# EAGLE schematic Piezoverstärker_v3.0 (EAGLE 9.6.2)
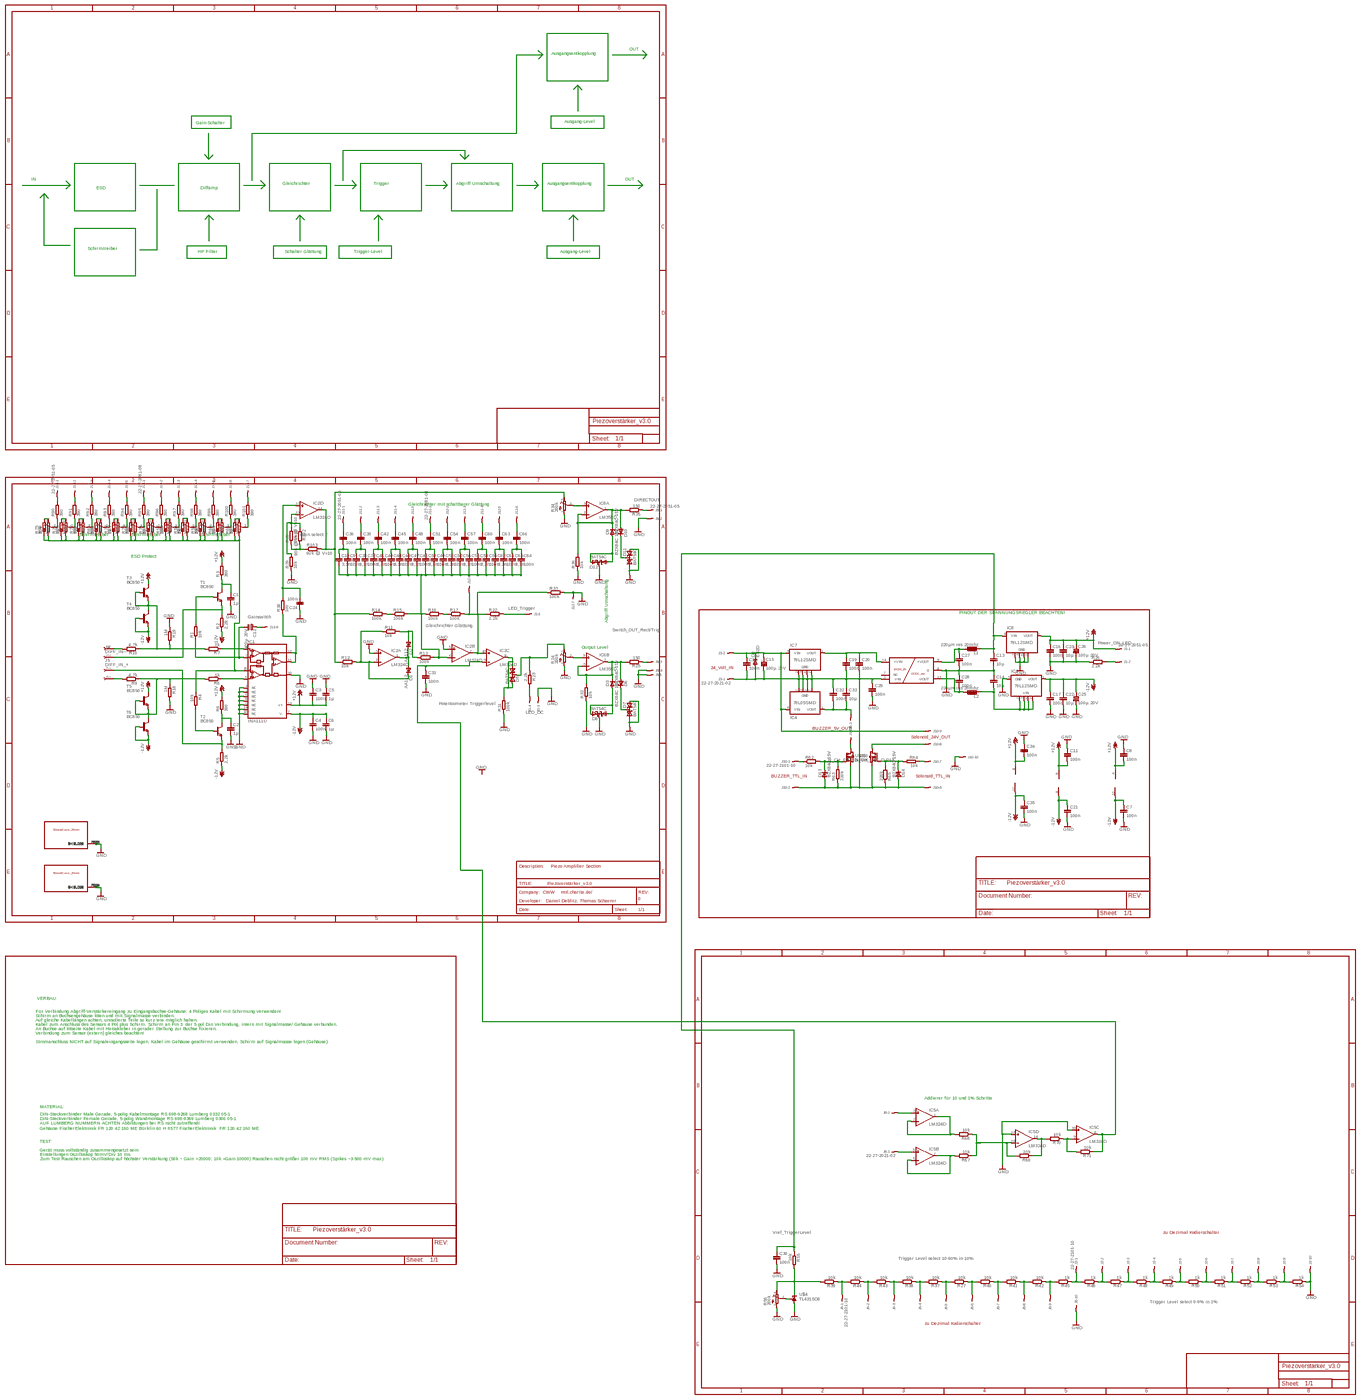
[diagram p0: schematic, sheet 1, overview]
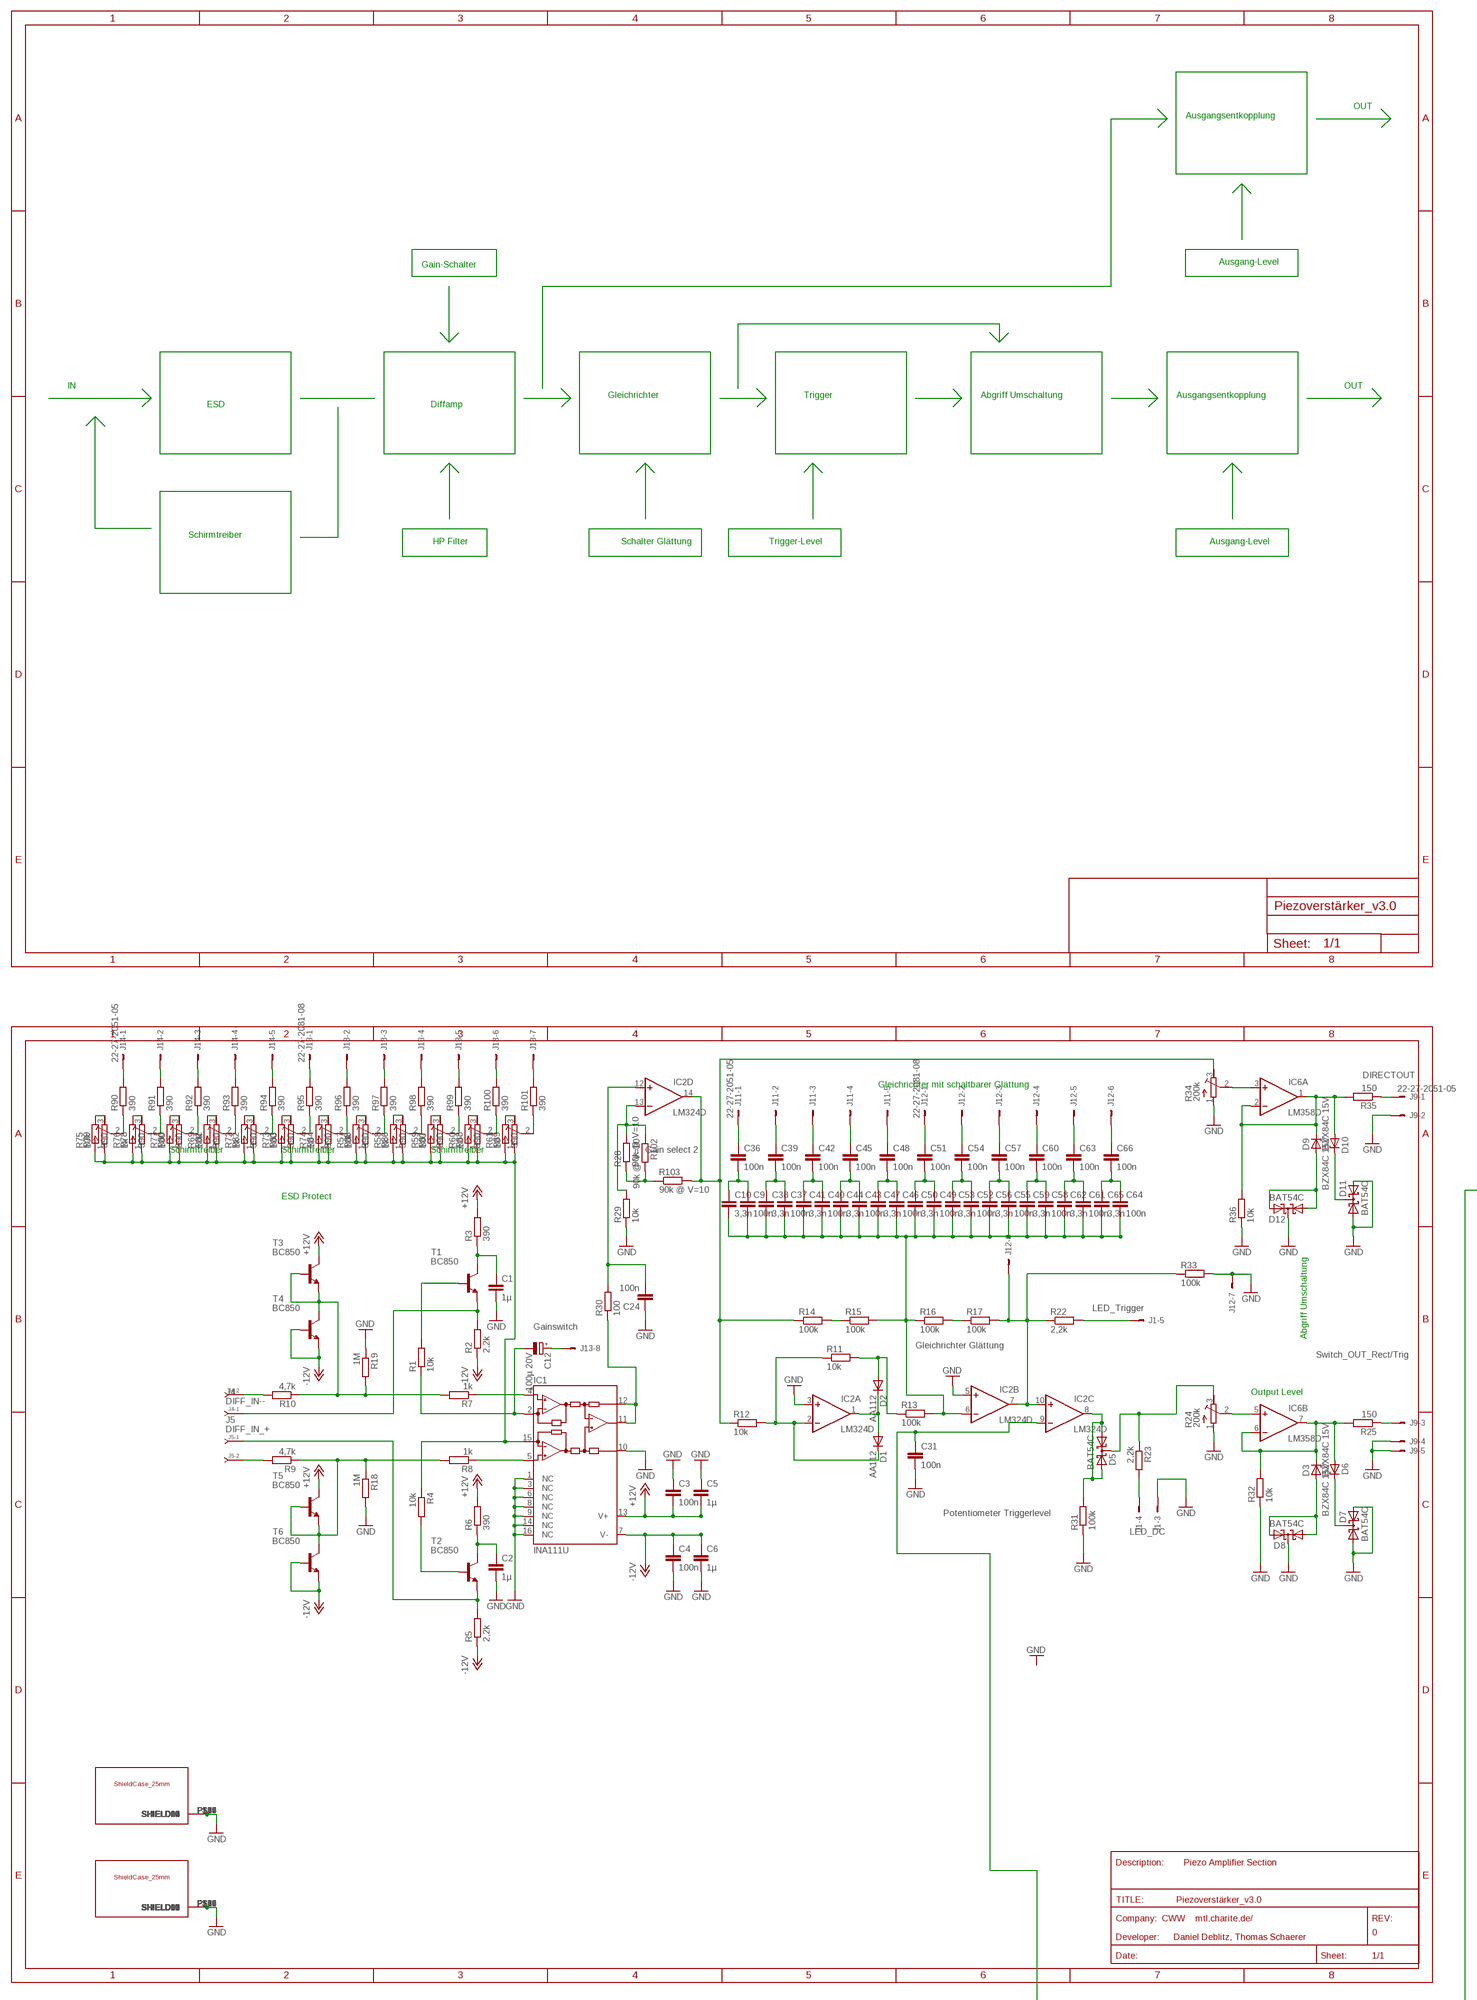
[diagram p1: schematic, sheet 1, part 1 of 4]
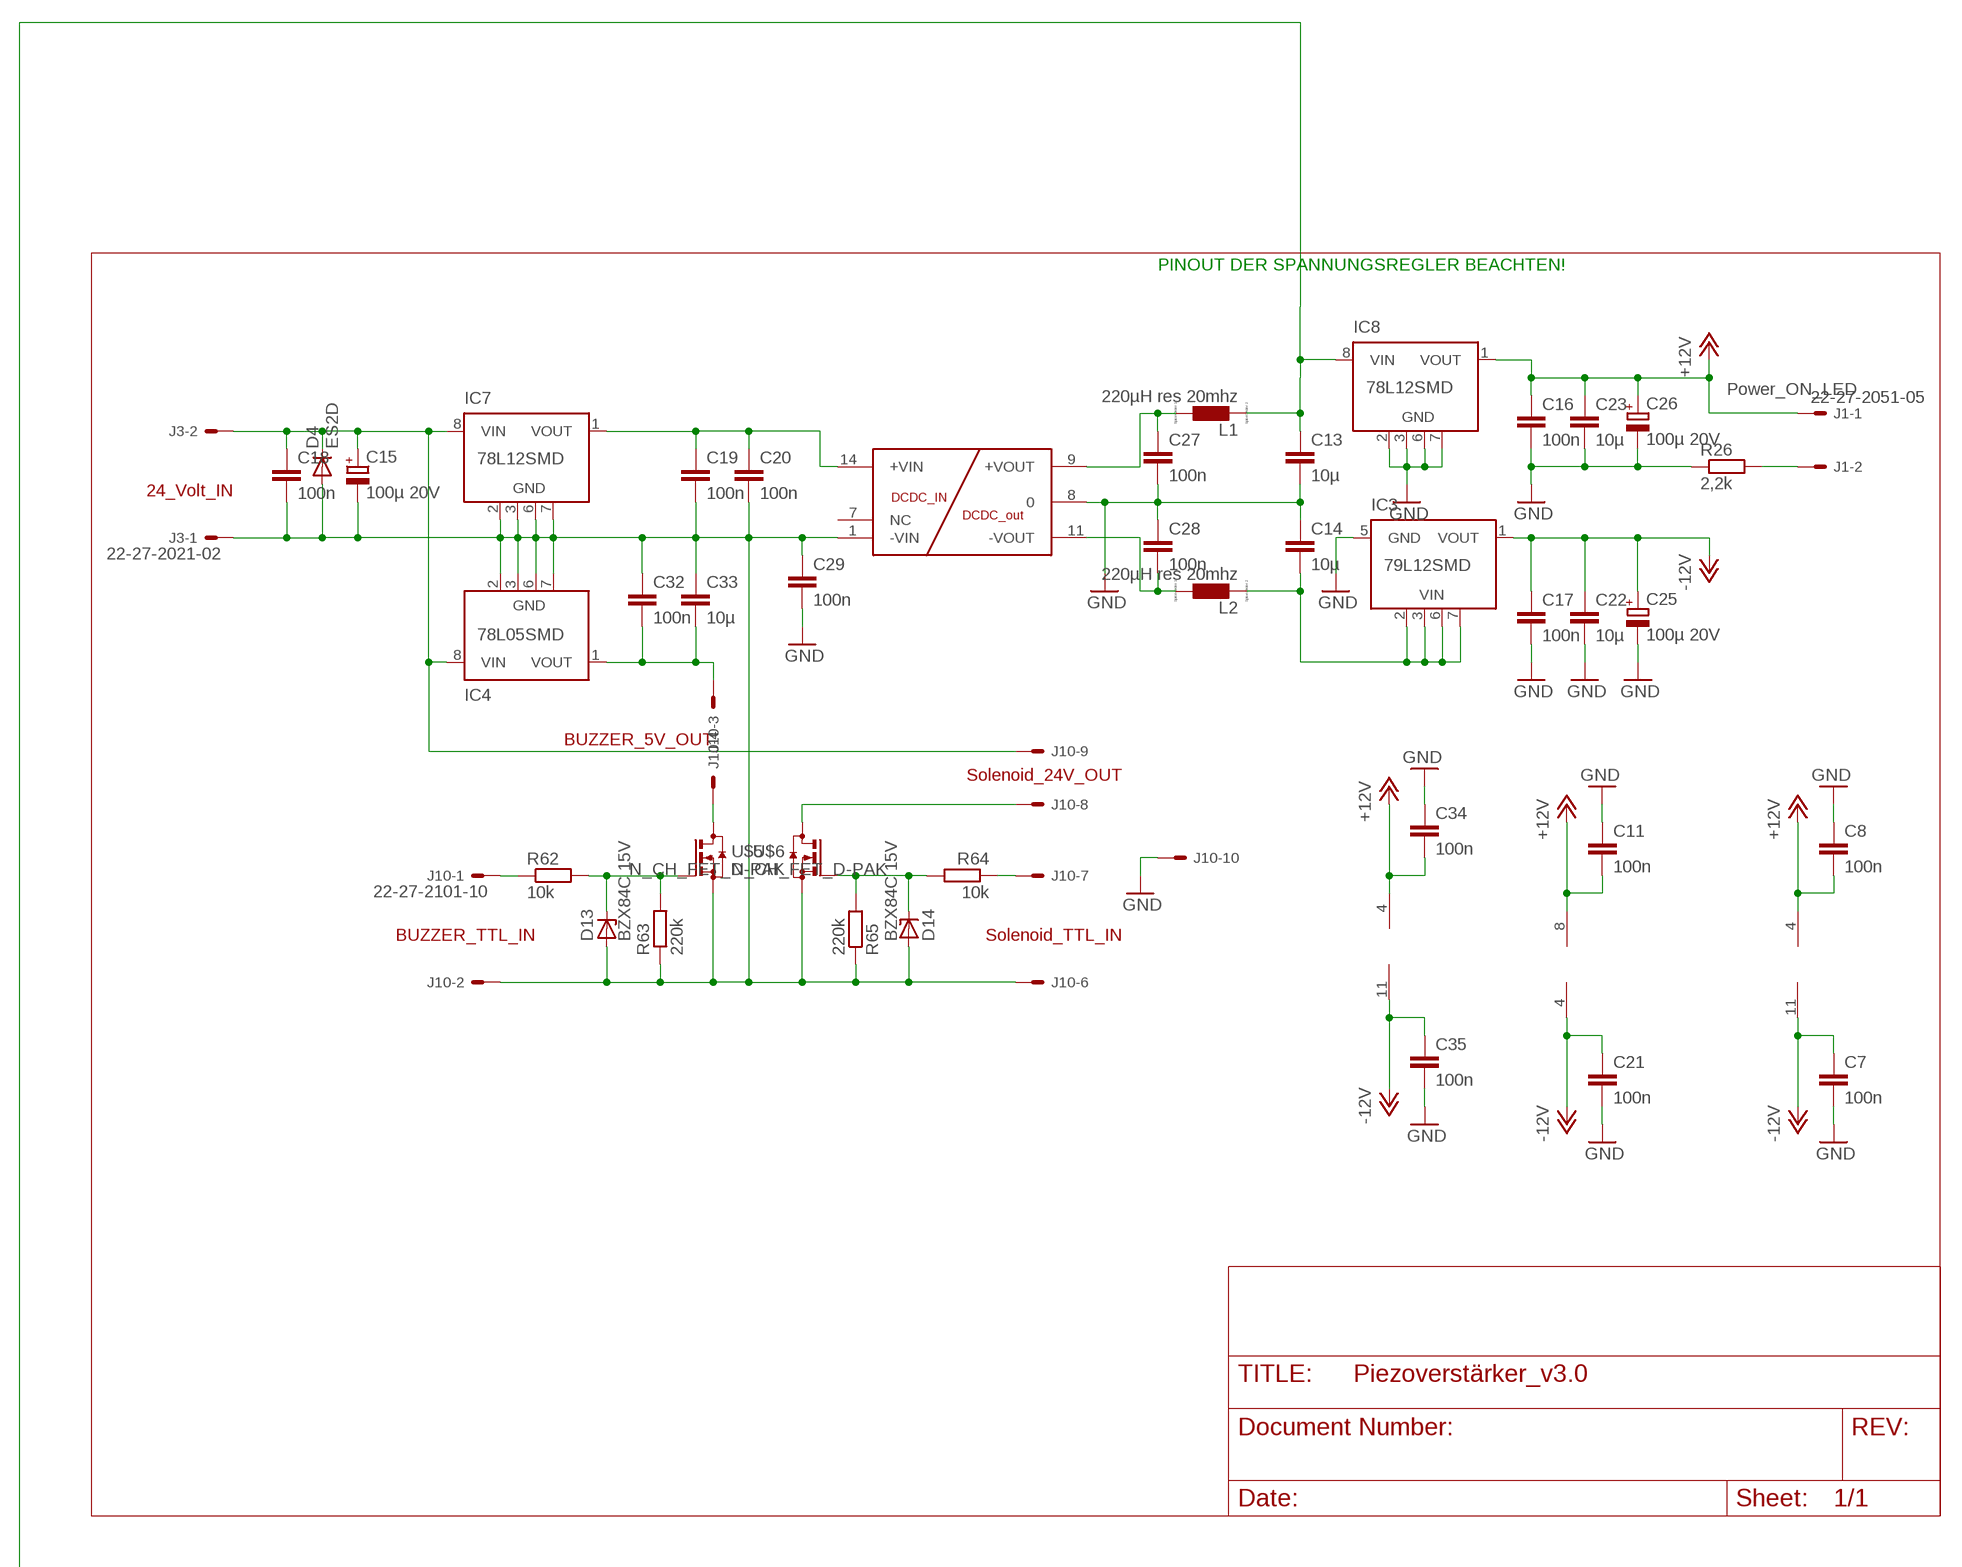
[diagram p2: schematic, sheet 1, part 2 of 4]
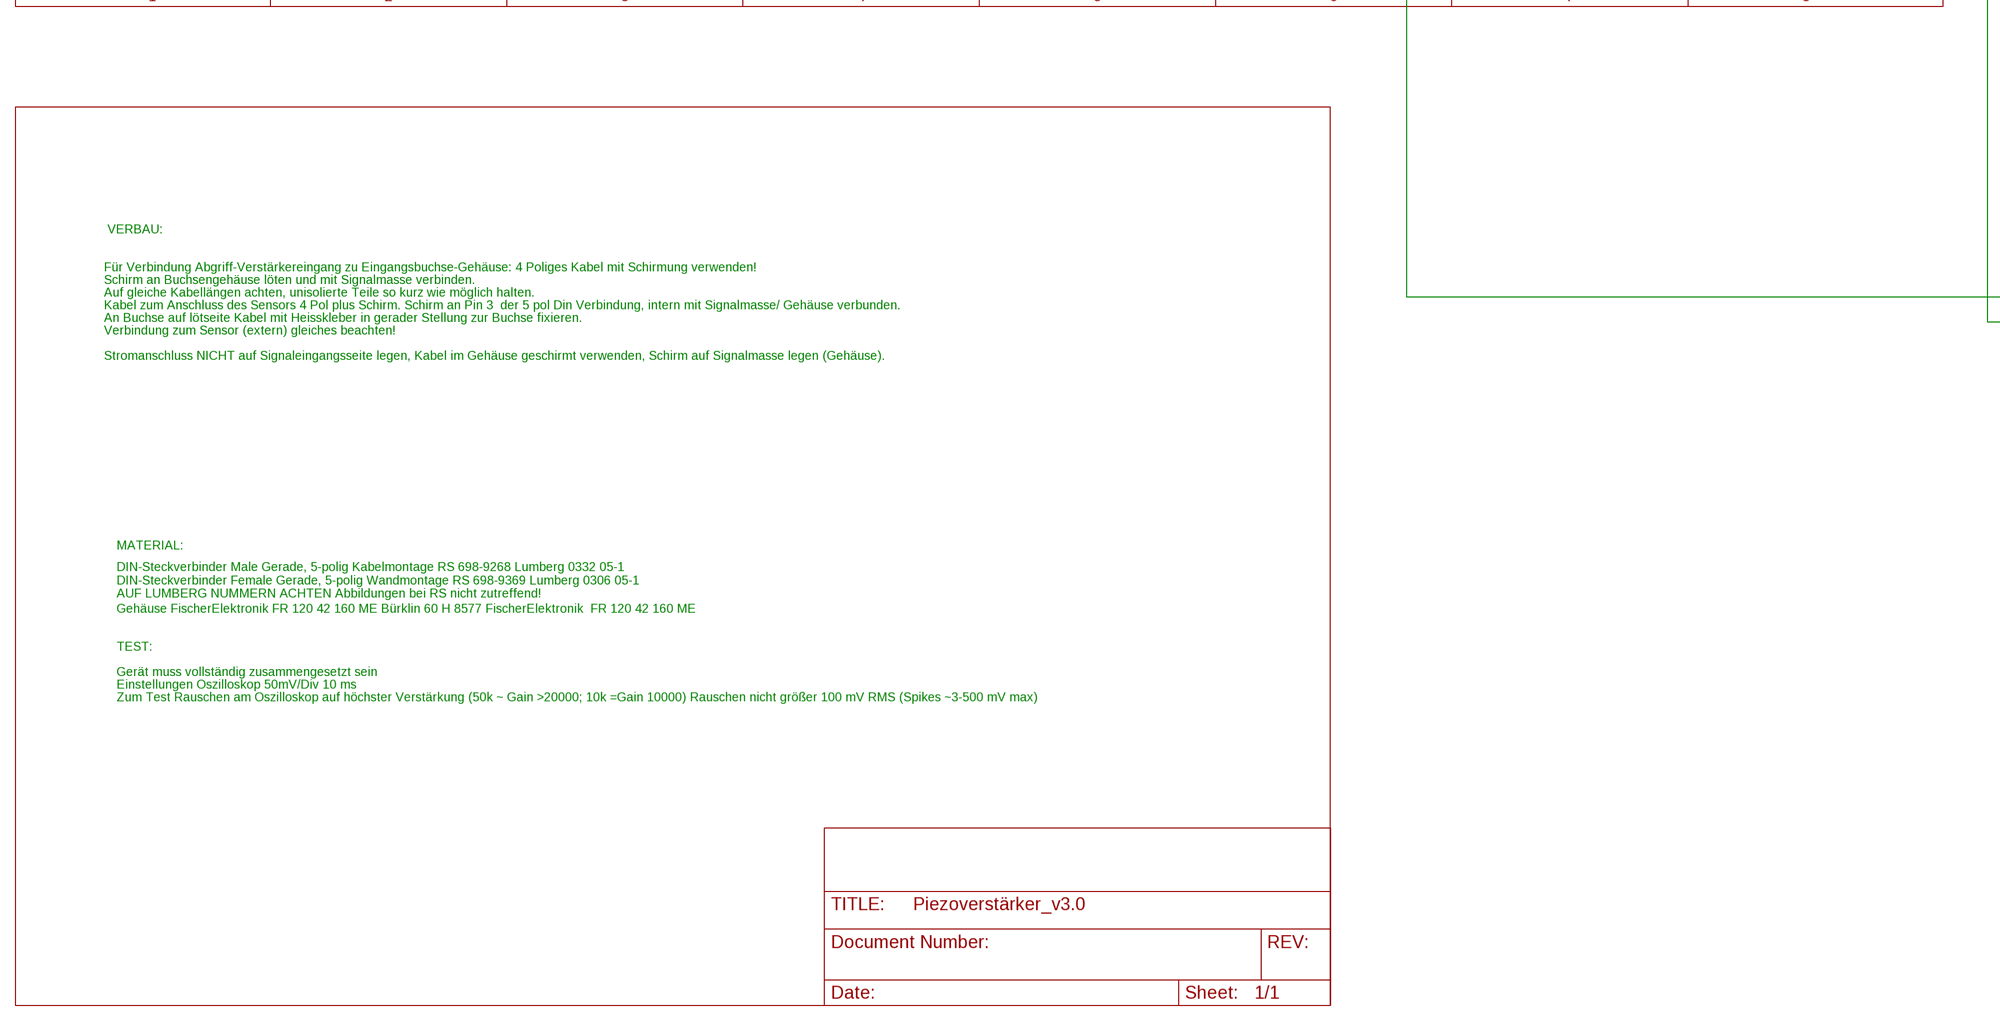
[diagram p3: schematic, sheet 1, part 3 of 4]
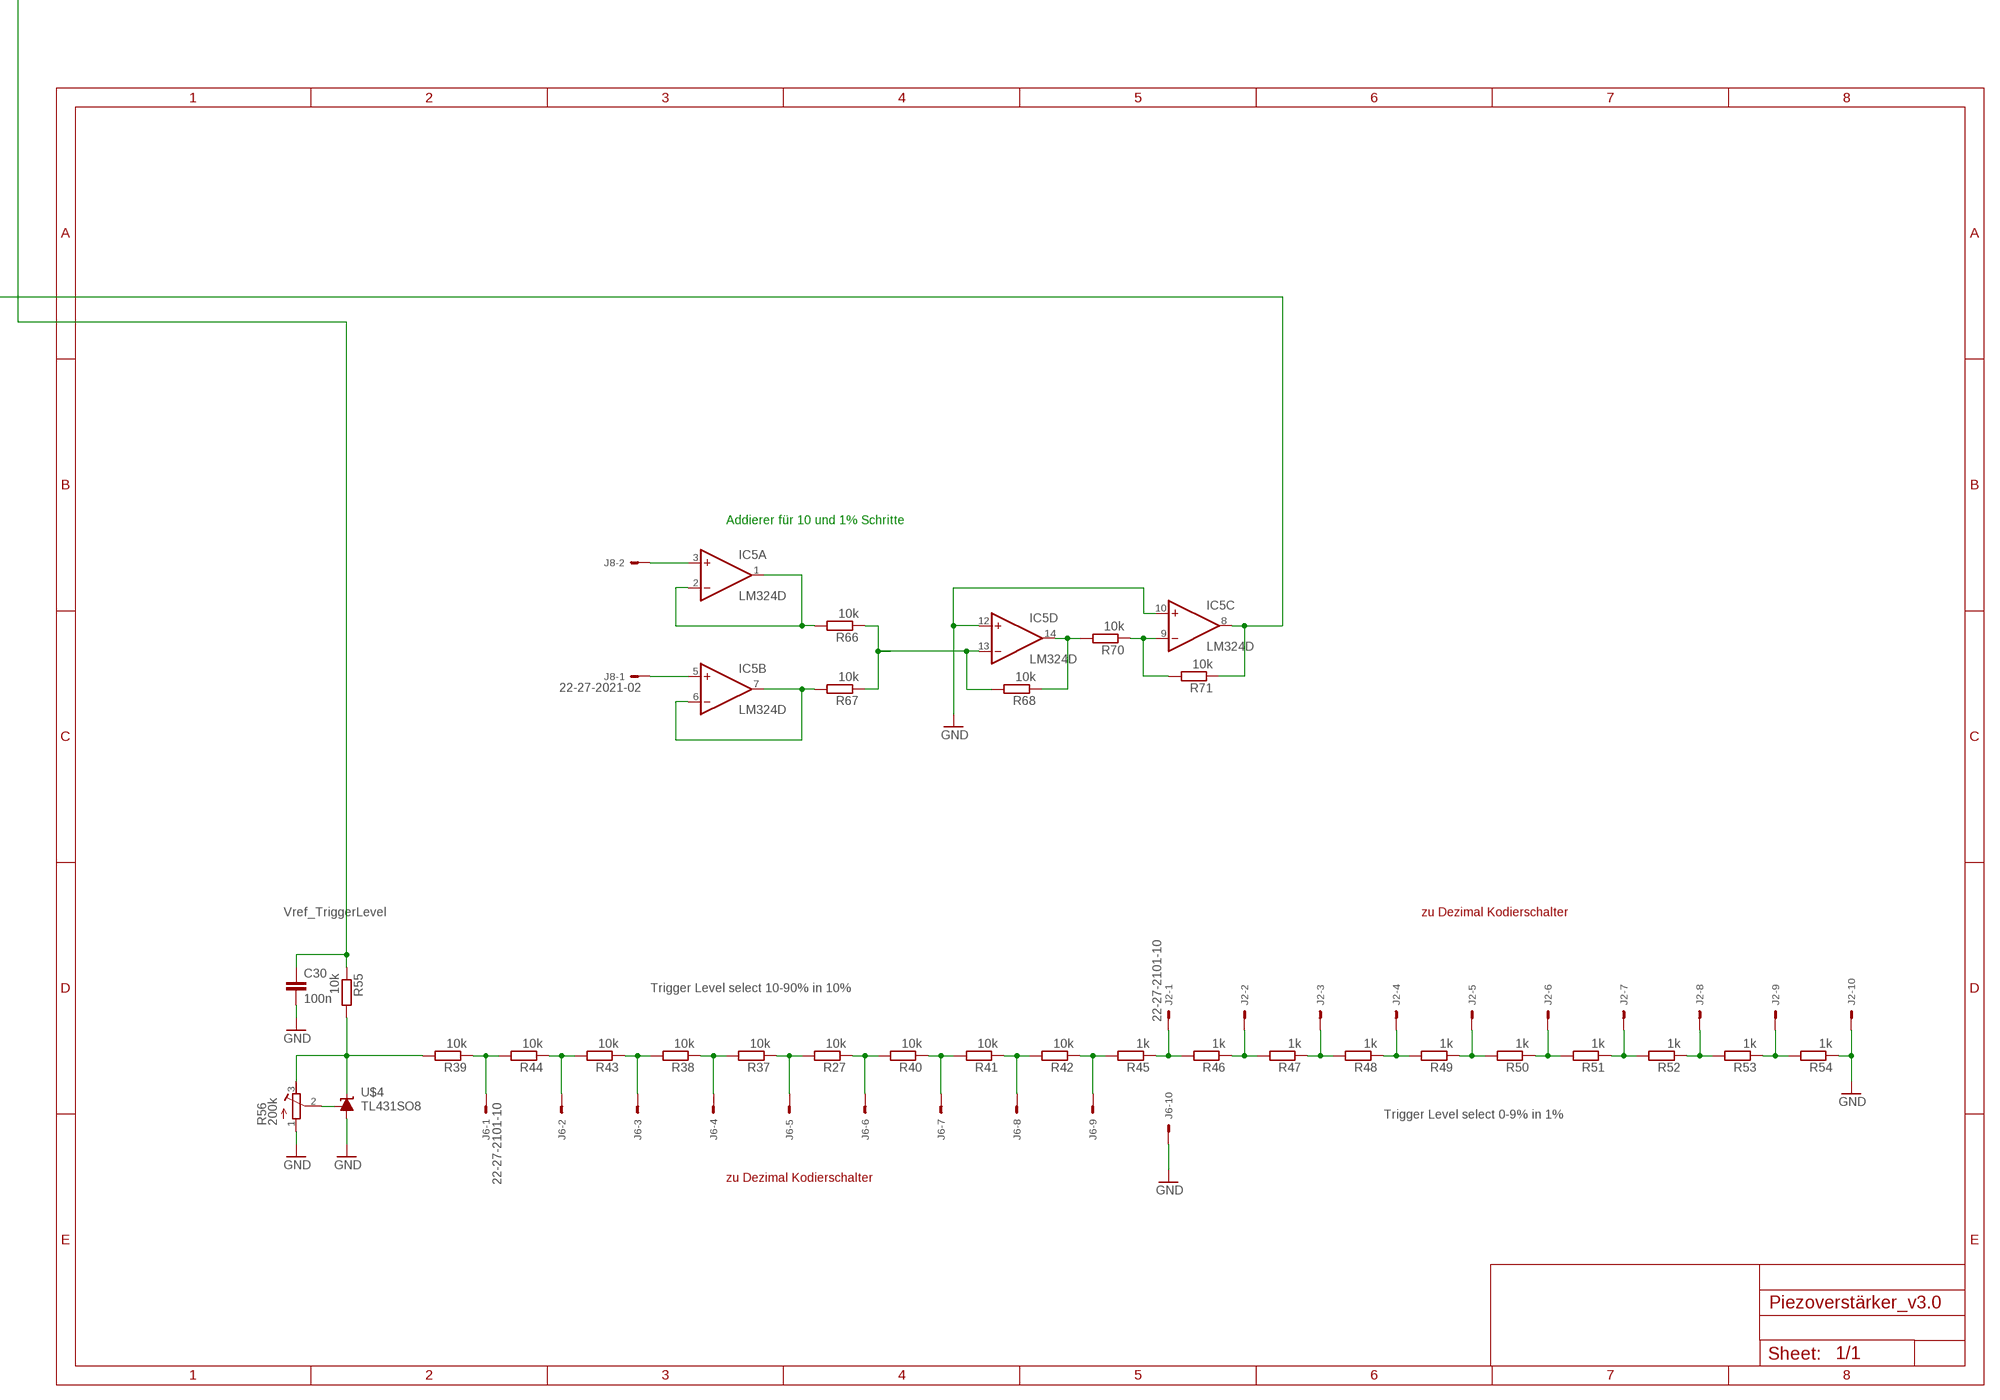
[diagram p4: schematic, sheet 1, part 4 of 4]

## Parts
C1  1µ  C-EUC0805  [C0805]
C2  1µ  C-EUC0805  [C0805]
C3  100n  C-EUC0805  [C0805]
C4  100n  C-EUC0805  [C0805]
C5  1µ  C-EUC0805  [C0805]
C6  1µ  C-EUC0805  [C0805]
C7  100n  C-EUC0805  [C0805]
C8  100n  C-EUC0805  [C0805]
C9  100n  C-EUC0805  [C0805]
C10  3,3n  C-EUC0805  [C0805]
C11  100n  C-EUC0805  [C0805]
C12  100µ 20V  CPOL-EUE  [PANASONIC_E]
C13  10µ  C-EUC0805  [C0805]
C14  10µ  C-EUC0805  [C0805]
C15  100µ 20V  CPOL-EUE  [PANASONIC_E]
C16  100n  C-EUC0805  [C0805]
C17  100n  C-EUC0805  [C0805]
C18  100n  C-EUC0805  [C0805]
C19  100n  C-EUC0805  [C0805]
C20  100n  C-EUC0805  [C0805]
C21  100n  C-EUC0805  [C0805]
C22  10µ  C-EUC0805  [C0805]
C23  10µ  C-EUC0805  [C0805]
C24  100n  C-EUC0805  [C0805]
C25  100µ 20V  CPOL-EUE  [PANASONIC_E]
C26  100µ 20V  CPOL-EUE  [PANASONIC_E]
C27  100n  C-EUC0805  [C0805]
C28  100n  C-EUC0805  [C0805]
C29  100n  C-EUC0805  [C0805]
C30  100n  C-EUC0805  [C0805]
C31  100n  C-EUC0805  [C0805]
C32  100n  C-EUC0805  [C0805]
C33  10µ  C-EUC0805  [C0805]
C34  100n  C-EUC0805  [C0805]
C35  100n  C-EUC0805  [C0805]
C36  100n  C-EUC0805  [C0805]
C37  100n  C-EUC0805  [C0805]
C38  3,3n  C-EUC0805  [C0805]
C39  100n  C-EUC0805  [C0805]
C40  100n  C-EUC0805  [C0805]
C41  3,3n  C-EUC0805  [C0805]
C42  100n  C-EUC0805  [C0805]
C43  100n  C-EUC0805  [C0805]
C44  3,3n  C-EUC0805  [C0805]
C45  100n  C-EUC0805  [C0805]
C46  100n  C-EUC0805  [C0805]
C47  3,3n  C-EUC0805  [C0805]
C48  100n  C-EUC0805  [C0805]
C49  100n  C-EUC0805  [C0805]
C50  3,3n  C-EUC0805  [C0805]
C51  100n  C-EUC0805  [C0805]
C52  100n  C-EUC0805  [C0805]
C53  3,3n  C-EUC0805  [C0805]
C54  100n  C-EUC0805  [C0805]
C55  100n  C-EUC0805  [C0805]
C56  3,3n  C-EUC0805  [C0805]
C57  100n  C-EUC0805  [C0805]
C58  100n  C-EUC0805  [C0805]
C59  3,3n  C-EUC0805  [C0805]
C60  100n  C-EUC0805  [C0805]
C61  100n  C-EUC0805  [C0805]
C62  3,3n  C-EUC0805  [C0805]
C63  100n  C-EUC0805  [C0805]
C64  100n  C-EUC0805  [C0805]
C65  3,3n  C-EUC0805  [C0805]
C66  100n  C-EUC0805  [C0805]
D1  AA112  [DO07]
D2  AA112  [DO07]
D3  BZX84C 15V  BZX84CSMD  [TO236]
D4  ES2D  [SMB]
D5  BAT54C  [SOT23]
D6  BZX84C 15V  BZX84CSMD  [TO236]
D7  BAT54C  [SOT23]
D8  BAT54C  [SOT23]
D9  BZX84C 15V  BZX84CSMD  [TO236]
D10  BZX84C 15V  BZX84CSMD  [TO236]
D11  BAT54C  [SOT23]
D12  BAT54C  [SOT23]
D13  BZX84C 15V  BZX84CSMD  [TO236]
D14  BZX84C 15V  BZX84CSMD  [TO236]
IC1  INA111U  [SO16-1]
IC2  LM324D  [SO14]
IC3  79L12SMD  [SO08]
IC4  78L05SMD  78L12SMD  [SO08]
IC5  LM324D  [SO14]
IC6  LM358D  [SO08]
IC7  78L12SMD  [SO08]
IC8  78L12SMD  [SO08]
J1  22-27-2051-05  [6410-05]
J2  22-27-2101-10  [6410-10]
J3  22-27-2021-02  [6410-02]
J4  DIFF_IN--  J-02-SIP-100-40  [SIP-100-02-40]
J5  DIFF_IN_+  J-02-SIP-100-40  [SIP-100-02-40]
J6  22-27-2101-10  [6410-10]
J8  22-27-2021-02  [6410-02]
J9  22-27-2051-05  [6410-05]
J10  22-27-2101-10  [6410-10]
J11  22-27-2051-05  [6410-05]
J12  22-27-2081-08  [6410-08]
J13  22-27-2081-08  [6410-08]
J14  22-27-2051-05  [6410-05]
L1  220µH res 20mhz  LL4532P  [L4532P]
L2  220µH res 20mhz  LL4532P  [L4532P]
R1  10k  R-EU_R0805  [R0805]
R2  2,2k  R-EU_R0805  [R0805]
R3  390  R-EU_R0805  [R0805]
R4  10k  R-EU_R0805  [R0805]
R5  2,2k  R-EU_R0805  [R0805]
R6  390  R-EU_R0805  [R0805]
R7  1k  R-EU_R0805  [R0805]
R8  1k  R-EU_R0805  [R0805]
R9  4,7k  R-EU_R0805  [R0805]
R10  4,7k  R-EU_R0805  [R0805]
R11  10k  R-EU_R0805  [R0805]
R12  10k  R-EU_R0805  [R0805]
R13  100k  R-EU_R0805  [R0805]
R14  100k  R-EU_R0805  [R0805]
R15  100k  R-EU_R0805  [R0805]
R16  100k  R-EU_R0805  [R0805]
R17  100k  R-EU_R0805  [R0805]
R18  1M  R-EU_R0805  [R0805]
R19  1M  R-EU_R0805  [R0805]
R22  2,2k  R-EU_R0805  [R0805]
R23  2,2k  R-EU_R0805  [R0805]
R24  200k  R-TRIMM74W  [RTRIM74W]
R25  150  R-EU_R0805  [R0805]
R26  2,2k  R-EU_R0805  [R0805]
R27  10k  R-EU_R0805  [R0805]
R28  90k @ V=10  R-EU_R0805  [R0805]
R29  10k  R-EU_R0805  [R0805]
R30  100  R-EU_R0805  [R0805]
R31  100k  R-EU_R0805  [R0805]
R32  10k  R-EU_R0805  [R0805]
R33  100k  R-EU_R0805  [R0805]
R34  200k  R-TRIMM74W  [RTRIM74W]
R35  150  R-EU_R0805  [R0805]
R36  10k  R-EU_R0805  [R0805]
R37  10k  R-EU_R0805  [R0805]
R38  10k  R-EU_R0805  [R0805]
R39  10k  R-EU_R0805  [R0805]
R40  10k  R-EU_R0805  [R0805]
R41  10k  R-EU_R0805  [R0805]
R42  10k  R-EU_R0805  [R0805]
R43  10k  R-EU_R0805  [R0805]
R44  10k  R-EU_R0805  [R0805]
R45  1k  R-EU_R0805  [R0805]
R46  1k  R-EU_R0805  [R0805]
R47  1k  R-EU_R0805  [R0805]
R48  1k  R-EU_R0805  [R0805]
R49  1k  R-EU_R0805  [R0805]
R50  1k  R-EU_R0805  [R0805]
R51  1k  R-EU_R0805  [R0805]
R52  1k  R-EU_R0805  [R0805]
R53  1k  R-EU_R0805  [R0805]
R54  1k  R-EU_R0805  [R0805]
R55  10k  R-EU_R0805  [R0805]
R56  200k  R-TRIMM74W  [RTRIM74W]
R57  10k  R-TRIMM74W  [RTRIM74W]
R58  1k  R-TRIMM74W  [RTRIM74W]
R59  100  R-TRIMM74W  [RTRIM74W]
R60  10  R-TRIMM74W  [RTRIM74W]
R61  10  R-TRIMM74W  [RTRIM74W]
R62  10k  R-EU_R0805  [R0805]
R63  220k  R-EU_R0805  [R0805]
R64  10k  R-EU_R0805  [R0805]
R65  220k  R-EU_R0805  [R0805]
R66  10k  R-EU_R0805  [R0805]
R67  10k  R-EU_R0805  [R0805]
R68  10k  R-EU_R0805  [R0805]
R69  10k  R-TRIMM74W  [RTRIM74W]
R70  10k  R-EU_R0805  [R0805]
R71  10k  R-EU_R0805  [R0805]
R72  1k  R-TRIMM74W  [RTRIM74W]
R73  100  R-TRIMM74W  [RTRIM74W]
R74  10  R-TRIMM74W  [RTRIM74W]
R75  10k  R-TRIMM74W  [RTRIM74W]
R76  1k  R-TRIMM74W  [RTRIM74W]
R77  100  R-TRIMM74W  [RTRIM74W]
R78  390  R-EU_R0805  [R0805]
R79  390  R-EU_R0805  [R0805]
R80  390  R-EU_R0805  [R0805]
R81  390  R-EU_R0805  [R0805]
R82  390  R-EU_R0805  [R0805]
R83  390  R-EU_R0805  [R0805]
R84  390  R-EU_R0805  [R0805]
R85  390  R-EU_R0805  [R0805]
R86  390  R-EU_R0805  [R0805]
R87  390  R-EU_R0805  [R0805]
R88  390  R-EU_R0805  [R0805]
R89  390  R-EU_R0805  [R0805]
R90  390  R-EU_R0805  [R0805]
R91  390  R-EU_R0805  [R0805]
R92  390  R-EU_R0805  [R0805]
R93  390  R-EU_R0805  [R0805]
R94  390  R-EU_R0805  [R0805]
R95  390  R-EU_R0805  [R0805]
R96  390  R-EU_R0805  [R0805]
R97  390  R-EU_R0805  [R0805]
R98  390  R-EU_R0805  [R0805]
R99  390  R-EU_R0805  [R0805]
R100  390  R-EU_R0805  [R0805]
R101  390  R-EU_R0805  [R0805]
R102  90k @ V=10  R-EU_R0805  [R0805]
R103  90k @ V=10  R-EU_R0805  [R0805]
T1  BC850  [SOT23]
T2  BC850  [SOT23]
T3  BC850  [SOT23]
T4  BC850  [SOT23]
T5  BC850  [SOT23]
T6  BC850  [SOT23]
U$1  MURATA_DCDC_NMA1215DC  MURATA_DCDC_NMA1212DC  [MURRATA_NMA_DCDC]
U$2  ABSCHIRMGEHäUSE_SMD_25MM  [ABSCHIRMGEHäUSE_SMD_25MM]
U$3  ABSCHIRMGEHäUSE_SMD_25MM  [ABSCHIRMGEHäUSE_SMD_25MM]
U$4  TL431SO8  [SO08]
U$5  N_CH_FET_D-PAK  [TO252]
U$6  N_CH_FET_D-PAK  [TO252]

## Nets
+12V: C3.2 C5.2 C8.2 C11.2 C16.1 C23.1 C26.+ C34.2 IC1.13(V+) IC2.4(P:V+) IC5.4(P:V+) IC6.8(P:V+) IC8.1(VOUT) J1.1 R3.2 R6.2 T3.3(C) T5.3(C)
+12VDC_DIRTY: C13.1 C30.1 IC8.8(VIN) L1.2 R55.1
-12V: C4.1 C6.1 C7.1 C17.1 C21.1 C22.1 C25.+ C35.1 IC1.7(V-) IC2.11(P:V-) IC3.1(VOUT) IC5.11(P:V-) IC6.4(P:V-) R2.1 R5.1 T4.1(B) T4.2(E) T6.1(B) T6.2(E)
DIFF_+: R8.2 R9.1 R18.1 T5.1(B) T5.2(E) T6.3(C)
DIFF_-: R7.2 R10.1 R19.2 T3.1(B) T3.2(E) T4.3(C)
GND: C1.2 C2.2 C3.1 C4.2 C5.1 C6.2 C7.2 C8.1 C11.1 C13.2 C14.1 C16.2 C17.2 C21.2 C22.2 C23.2 C24.1 C25.- C26.- C27.2 C28.1 C29.2 C30.2 C31.2 C34.1 C35.2 D7.1(A1) D7.2(A2) D8.3(CC) D11.1(A1) D11.2(A2) D12.3(CC) IC1.1(NC) IC1.3(NC) IC1.6(NC) IC1.8(NC) IC1.9(NC) IC1.10(REF) IC1.14(NC) IC1.16(NC) IC2.3(A:+IN) IC2.5(B:+IN) IC3.5(GND) IC5.10(C:+IN) IC5.12(D:+IN) IC8.2(GND) IC8.3(GND) IC8.6(GND) IC8.7(GND) J1.3 J2.10 J6.10 J9.2 J9.4 J9.5 J10.10 J12.7 R18.2 R19.1 R24.1(E) R26.1 R29.1 R31.1 R32.1 R33.2 R34.1(E) R36.1 R54.1 R56.1(E) U$1.8 U$2.P$1(SHIELD00) U$2.P$2(SHIELD01) U$2.P$3(SHIELD02) U$2.P$4(SHIELD03) U$2.P$5(SHIELD04) U$2.P$6(SHIELD05) U$2.P$7(SHIELD06) U$2.P$8(SHIELD07) U$2.P$9(SHIELD08) U$2.P$10(SHIELD09) U$2.P$11(SHIELD10) U$2.P$12(SHIELD11) U$2.P$13(SHIELD12) U$2.P$14(SHIELD13) U$2.P$15(SHIELD14) U$2.P$16(SHIELD15) U$2.P$17(SHIELD16) U$2.P$18(SHIELD17) U$2.P$19(SHIELD18) U$2.P$20(SHIELD19) U$3.P$1(SHIELD00) U$3.P$2(SHIELD01) U$3.P$3(SHIELD02) U$3.P$4(SHIELD03) U$3.P$5(SHIELD04) U$3.P$6(SHIELD05) U$3.P$7(SHIELD06) U$3.P$8(SHIELD07) U$3.P$9(SHIELD08) U$3.P$10(SHIELD09) U$3.P$11(SHIELD10) U$3.P$12(SHIELD11) U$3.P$13(SHIELD12) U$3.P$14(SHIELD13) U$3.P$15(SHIELD14) U$3.P$16(SHIELD15) U$3.P$17(SHIELD16) U$3.P$18(SHIELD17) U$3.P$19(SHIELD18) U$3.P$20(SHIELD19) U$4.2(A)
N$1: C1.1 R3.1 T1.3(C)
N$2: IC1.11(OUT) IC1.12(FB) R30.1
N$3: R1.2 T1.1(B)
N$4: C12.- IC1.2(RG) R1.1
N$5: C2.1 R6.1 T2.3(C)
N$6: IC1.5(+IN) R8.1
N$7: R4.2 T2.1(B)
N$8: R75.2(S) R90.1
N$9: IC1.4(-IN) R7.1
N$10: R75.3(A) R79.2
N$11: J4.2 R10.2
N$12: J5.2 R9.2
N$13: IC6.5(B:+IN) R24.2(S)
N$14: C12.+ J13.8
N$15: D1.A D2.C IC2.1(A:OUT)
N$16: D5.1(A1) D5.2(A2) IC2.8(C:OUT) R31.2
N$17: D2.A R11.2 R13.1
N$18: J9.3 R25.1
N$19: C28.2 L2.1 U$1.11(-VOUT)
N$20: R14.2 R15.1
N$21: R16.2 R17.1
N$22: IC2.7(B:OUT) IC2.10(C:+IN) J12.8 R17.2 R22.1 R33.1
N$23: C9.2 C10.2 C37.2 C38.2 C40.2 C41.2 C43.2 C44.2 C46.2 C47.2 C49.2 C50.2 C52.2 C53.2 C55.2 C56.2 C58.2 C59.2 C61.2 C62.2 C64.2 C65.2 IC2.6(B:-IN) R13.2 R15.2 R16.1
N$24: C9.1 C10.1 C36.2
N$25: C45.1 J11.4
N$27: C37.1 C38.1 C39.2
N$28: R76.3(A) R78.2
N$29: R77.3(A) R80.2
N$30: J1.5 R22.2
N$31: J1.4 R23.2
N$32: R39.2 R55.2 R56.3(A) U$4.1(C)
N$33: D5.3(CC) R23.1 R24.3(A)
N$34: D3.A D8.1(A1) D8.2(A2)
N$35: D3.C D6.A IC6.6(B:-IN) IC6.7(B:OUT) R25.2 R32.2
N$37: C27.1 L1.1 U$1.9(+VOUT)
N$38: J2.9 R53.1 R54.2
N$39: C15.+ C18.1 D4.C IC4.8(VIN) IC7.8(VIN) J3.2 J10.9
N$40: C19.1 C20.1 IC7.1(VOUT) U$1.14(+VIN)
N$66: D1.C IC2.2(A:-IN) R11.1 R12.2
N$67: D6.C D7.3(CC)
N$70: D9.C D10.A IC6.1(A:OUT) IC6.2(A:-IN) R35.2 R36.2
N$71: IC6.3(A:+IN) R34.2(S)
N$72: J9.1 R35.1
N$73: J1.2 R26.2
N$74: D9.A D12.1(A1) D12.2(A2)
N$75: D10.C D11.3(CC)
N$76: IC2.13(D:-IN) R28.2 R29.2 R102.1
N$77: C42.1 J11.3
N$78: IC2.14(D:OUT) R12.1 R14.1 R34.3(A) R103.2
N$79: J2.8 R52.1 R53.2
N$80: C24.2 IC2.12(D:+IN) R30.2
N$81: J2.7 R51.1 R52.2
N$82: J2.6 R50.1 R51.2
N$83: J2.5 R49.1 R50.2
N$84: J2.4 R48.1 R49.2
N$85: J2.3 R47.1 R48.2
N$86: J2.2 R46.1 R47.2
N$87: J2.1 R45.1 R46.2
N$88: J6.9 R42.1 R45.2
N$89: J6.8 R41.1 R42.2
N$90: J6.7 R40.1 R41.2
N$91: J6.6 R27.1 R40.2
N$92: J6.5 R27.2 R37.1
N$93: J6.4 R37.2 R38.1
N$94: J6.3 R38.2 R43.1
N$95: J6.2 R43.2 R44.1
N$96: J6.1 R39.1 R44.2
N$97: R56.2(S) U$4.8(FB)
N$98: C40.1 C41.1 C42.2
N$99: C39.1 J11.2
N$100: C43.1 C44.1 C45.2
N$101: C36.1 J11.1
N$102: IC1.15(RG) R4.1 R57.1(E) R58.1(E) R59.1(E) R60.1(E) R61.1(E) R69.1(E) R72.1(E) R73.1(E) R74.1(E) R75.1(E) R76.1(E) R77.1(E) R78.1 R79.1 R80.1 R81.1 R82.1 R83.1 R84.1 R85.1 R86.1 R87.1 R88.1 R89.1
N$103: C32.2 C33.2 IC4.1(VOUT) J10.3
N$104: J10.4 U$5.3(D)
N$105: J10.1 R62.1
N$106: D13.C R62.2 R63.2 U$5.1(G)
N$107: J10.8 U$6.3(D)
N$108: J10.7 R64.1
N$109: D14.C R64.2 R65.2 U$6.1(G)
N$110: IC5.6(B:-IN) IC5.7(B:OUT) R67.2
N$111: IC5.1(A:OUT) IC5.2(A:-IN) R66.2
N$112: IC5.5(B:+IN) J8.1
N$113: IC5.3(A:+IN) J8.2
N$114: C46.1 C47.1 C48.2
N$115: IC5.13(D:-IN) R66.1 R67.1 R68.2
N$116: IC5.14(D:OUT) R68.1 R70.2
N$117: IC5.9(C:-IN) R70.1 R71.2
N$118: C48.1 J11.5
N$119: C49.1 C50.1 C51.2
N$120: C51.1 J12.1
N$121: C52.1 C53.1 C54.2
N$122: C54.1 J12.2
N$123: C55.1 C56.1 C57.2
N$124: C57.1 J12.3
N$125: C58.1 C59.1 C60.2
N$126: C60.1 J12.4
N$127: C61.1 C62.1 C63.2
N$128: C63.1 J12.5
N$129: C64.1 C65.1 C66.2
N$130: C66.1 J12.6
N$131: R76.2(S) R91.1
N$132: R77.2(S) R92.1
N$133: R69.2(S) R93.1
N$134: R72.2(S) R94.1
N$135: R73.2(S) R95.1
N$136: R74.2(S) R96.1
N$137: R57.2(S) R97.1
N$138: R58.2(S) R98.1
N$139: R59.2(S) R99.1
N$140: R60.2(S) R100.1
N$141: R61.2(S) R101.1
N$142: J14.1 R90.2
N$143: J14.2 R91.2
N$144: J14.3 R92.2
N$145: J14.4 R93.2
N$146: J14.5 R94.2
N$147: J13.1 R95.2
N$148: J13.2 R96.2
N$149: J13.3 R97.2
N$150: J13.4 R98.2
N$151: J13.5 R99.2
N$152: J13.6 R100.2
N$153: J13.7 R101.2
N$154: R28.1 R102.2 R103.1
N$155: R69.3(A) R81.2
N$156: R72.3(A) R82.2
N$157: R73.3(A) R83.2
N$158: R74.3(A) R84.2
N$159: R57.3(A) R85.2
N$160: R58.3(A) R86.2
N$161: R59.3(A) R87.2
N$162: R60.3(A) R88.2
N$163: R61.3(A) R89.2
SCHIR_DIFF_+: J5.1 R5.2 T2.2(E)
SCHIR_DIFF_-: J4.1 R2.2 T1.2(E)
T1: C15.- C18.2 C19.2 C20.2 C29.1 C32.1 C33.1 D4.A D13.A D14.A IC4.2(GND) IC4.3(GND) IC4.6(GND) IC4.7(GND) IC7.2(GND) IC7.3(GND) IC7.6(GND) IC7.7(GND) J3.1 J10.2 J10.6 R63.1 R65.1 U$1.1(-VIN) U$5.2(S) U$6.2(S)
T2: C14.2 IC3.2(VIN) IC3.3(VIN) IC3.6(VIN) IC3.7(VIN) L2.2
TRIGGER_LEVELSET_IN: C31.1 IC2.9(C:-IN) IC5.8(C:OUT) R71.1
Unconnected: IC3.4(NC) IC3.8(NC) IC4.4(NC) IC4.5(NC) IC7.4(NC) IC7.5(NC) IC8.4(NC) IC8.5(NC) J10.5 U$1.7(NC)

## Notes on the sheet
- OUT
- Ausgangsentkopplung
- Ausgang-Level
- Gain-Schalter
- IN | OUT
- Gleichrichter | Trigger | Abgriff Umschaltung | Ausgangsentkopplung
- ESD | Diffamp
- Schirmtreiber | HP Filter | Schalter Glättung | Trigger-Level | Ausgang-Level
- DIRECTOUT
- Gleichrichter mit schaltbarer Glättung
- Schirmtreiber | Schirmtreiber | Schirmtreiber | Gain select 2
- ESD Protect
- LED_Trigger
- PINOUT DER SPANNUNGSREGLER BEACHTEN!
- Gainswitch
- Abgriff Umschaltung
- Gleichrichter Glättung
- Switch_OUT_Rect/Trig
- Power_ON_LED
- Output Level
- 24_Volt_IN
- Potentiometer Triggerlevel
- LED_DC
- BUZZER_5V_OUT
- Solenoid_24V_OUT
- BUZZER_TTL_IN | Solenoid_TTL_IN
- Piezo Amplifier Section
- Daniel Deblitz, Thomas Schaerer
- VERBAU:
- Für Verbindung Abgriff-Verstärkereingang zu Eingangsbuchse-Gehäuse: 4 Poliges Kabel mit Schirmung verwenden!
- Schirm an Buchsengehäuse löten und mit Signalmasse verbinden.
- Auf gleiche Kabellängen achten, unisolierte Teile so kurz wie möglich halten.
- Kabel zum Anschluss des Sensors 4 Pol plus Schirm. Schirm an Pin 3  der 5 pol Din Verbindung, intern mit Signalmasse/ Gehäuse verbunden.
- An Buchse auf lötseite Kabel mit Heisskleber in gerader Stellung zur Buchse fixieren.
- Verbindung zum Sensor (extern) gleiches beachten!
- Stromanschluss NICHT auf Signaleingangsseite legen, Kabel im Gehäuse geschirmt verwenden, Schirm auf Signalmasse legen (Gehäuse).
- Addierer für 10 und 1% Schritte
- MATERIAL:
- DIN-Steckverbinder Male Gerade, 5-polig Kabelmontage RS 698-9268 Lumberg 0332 05-1
  DIN-Steckverbinder Female Gerade, 5-polig Wandmontage RS 698-9369 Lumberg 0306 05-1
  AUF LUMBERG NUMMERN ACHTEN Abbildungen bei RS nicht zutreffend!
- Gehäuse FischerElektronik FR 120 42 160 ME Bürklin 60 H 8577 FischerElektronik  FR 120 42 160 ME
- TEST:
- Gerät muss vollständig zusammengesetzt sein
- Einstellungen Oszilloskop 50mV/Div 10 ms
- Zum Test Rauschen am Oszilloskop auf höchster Verstärkung (50k ~ Gain >20000; 10k =Gain 10000) Rauschen nicht größer 100 mV RMS (Spikes ~3-500 mV max)
- Vref_TriggerLevel | zu Dezimal Kodierschalter
- Trigger Level select 10-90% in 10%
- Trigger Level select 0-9% in 1%
- zu Dezimal Kodierschalter

## Library data of the parts
C1-C11 C13 C14 C16-C24 C27-C66 = rcl:C-EU: CAPACITOR, European symbol
C12 C15 C25 C26 = resistor:CPOL-EU: POLARIZED CAPACITOR, European symbol
D1 D2 = diode:AA112: DIODE germanium
D3 D6 D9 D10 D13 D14 = diode:BZX84CSMD: Z DIODE
D4 = diode:ES2D: DIODE super fast rectifier, 2 A
D5 D7 D8 D11 D12 = diode:BAT54C: Schottky Diodes Source: Fairchild .. BAT54.pdf
IC1 = burr-brown:INA111U: Precision Instrumentation Amplifier; MF: TEXAS INSTRUMENT CONNECTORS; MPN: INA111BP; OC_FARNELL: 1212397; OC_NEWARK: 27C4351
IC2 IC5 = linear:LM324: OP AMP
IC3 = MTL-Eagle-Bibliothek:79L*SMD: Negative VOLTAGE REGULATOR
IC4 IC7 IC8 = linear:78L*SMD: Positive VOLTAGE REGULATOR
IC6 = linear:LM358: OP AMP also LM158; LM258; LM2904 Source: http://cache.national.com/ds/LM/LM158.pdf
J1 J9 J11 J14 = con-molex:22-?-05: CONNECTOR wire to board 2.54 mm (.1 inch) pitch header; OC_FARNELL: unknown; OC_NEWARK: unknown
J2 J6 J10 = con-molex:22-?-10: CONNECTOR wire to board 2.54 mm (.1 inch) pitch header; OC_FARNELL: unknown; OC_NEWARK: unknown
J3 J8 = con-molex:22-?-02: CONNECTOR wire to board 2.54 mm (.1 inch) pitch header; OC_FARNELL: unknown; OC_NEWARK: unknown
J4 J5 = con-headers-jp:J-02-: HEADER JACK PINS
J12 J13 = con-molex:22-?-08: CONNECTOR wire to board 2.54 mm (.1 inch) pitch header; OC_FARNELL: unknown; OC_NEWARK: unknown
L1 L2 = eagle-ltspice:L: INDUCTOR, European symbol; SPICEMODEL: NONE; SPICEPREFIX: L
R1-R11 R13-R19 R22 R23 R25-R33 R35-R55 R62-R68 R70 R71 R78-R103 = resistor:R-EU_: RESISTOR, European symbol
R12 = rcl:R-EU_: RESISTOR, European symbol
R24 R34 R56-R61 R69 R72-R77 = resistor:R-TRIMM: Trimm resistor
T1-T6 = transistor:BC850: NPN TRANSISTOR
U$1 = MTL-Eagle-Bibliothek:MURATA_DCDC_NMA1212DC
U$2 U$3 = MTL-Eagle-Bibliothek:ABSCHIRMGEHäUSE_SMD_25MM: Abschirm Case 25x25 mm; 3mm Innenhöhe
U$4 = MTL-Eagle-Bibliothek:TL431*: adjustable voltage reference
U$5 U$6 = MTL-Eagle-Bibliothek:N_CH_FET_D-PAK